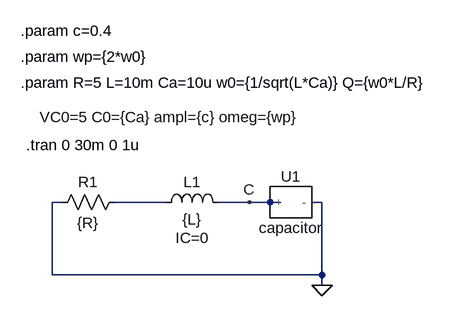
[diagram p0: schematic parametric_oscillator.asc]
parametric_oscillator.asc, the LTspice schematic file:
Version 4
SHEET 1 1448 680
WIRE 128 128 112 128
WIRE 288 128 208 128
WIRE 416 128 368 128
WIRE 448 128 416 128
WIRE 464 128 448 128
WIRE 528 128 512 128
WIRE 112 240 112 128
WIRE 528 240 528 128
WIRE 528 240 112 240
WIRE 528 256 528 240
FLAG 528 256 0
FLAG 416 128 C
SYMBOL res 224 112 R90
WINDOW 0 0 56 VBottom 2
WINDOW 3 32 56 VTop 2
SYMATTR InstName R1
SYMATTR Value {R}
SYMBOL ind 272 144 R270
WINDOW 0 32 56 VTop 2
WINDOW 3 5 56 VBottom 2
WINDOW 39 -23 56 VBottom 2
SYMATTR InstName L1
SYMATTR Value {L}
SYMATTR SpiceLine IC=0
SYMBOL capacitor 480 128 R0
WINDOW 39 -185 -147 Top 2
SYMATTR SpiceLine VC0=5 C0={Ca} ampl={c} omeg={wp}
SYMATTR InstName U1
TEXT 72 40 Left 2 !.tran 0 30m 0 1u
TEXT 64 -56 Left 2 !.param R=5 L=10m Ca=10u w0={1/sqrt(L*Ca)} Q={w0*L/R}
TEXT 64 -136 Left 2 !.param c=0.4
TEXT 64 -96 Left 2 !.param wp={2*w0}

The netlist it stands for:
* parametric_oscillator.asc
R1 N001 0 {R}
L1 N001 C {L} IC=0
XU1 C 0 capacitor VC0=5 C0={Ca} ampl={c} omeg={wp}  ; pins + -
.tran 0 30m 0 1u
.param R=5 L=10m Ca=10u w0={1/sqrt(L*Ca)} Q={w0*L/R}
.param c=0.4
.param wp={2*w0}
.lib C:\Users\erizo\Desktop\JR2-IMSC\ltspice\varcap.txt
.backanno
.end